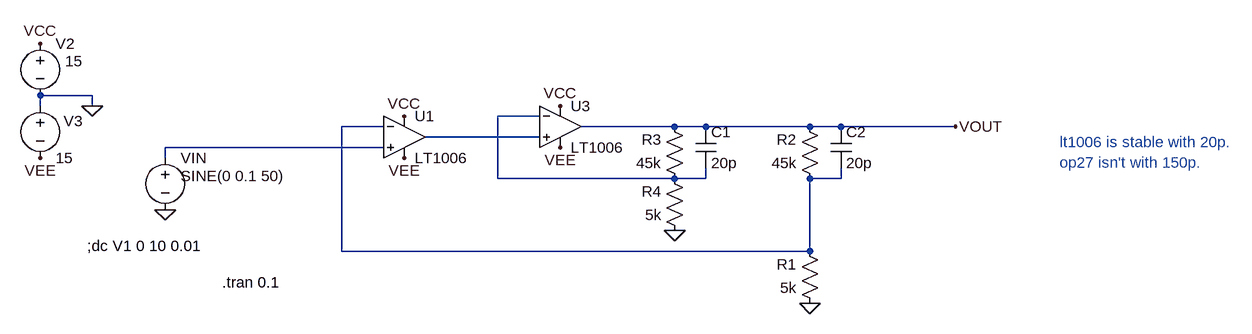
[diagram p0: schematic Draft22.asc]
Draft22.asc, the LTspice schematic file:
Version 4
SHEET 1 1736 680
WIRE -64 32 -144 32
WIRE -144 48 -144 32
WIRE -64 48 -64 32
WIRE 624 64 560 64
WIRE 384 80 320 80
WIRE 832 80 688 80
WIRE 880 80 832 80
WIRE 1040 80 880 80
WIRE 1088 80 1040 80
WIRE 1264 80 1088 80
WIRE 624 96 448 96
WIRE 384 112 48 112
WIRE 48 128 48 112
WIRE 560 160 560 64
WIRE 832 160 560 160
WIRE 880 160 880 144
WIRE 880 160 832 160
WIRE 1088 160 1088 144
WIRE 1088 160 1040 160
WIRE 320 272 320 80
WIRE 1040 272 1040 160
WIRE 1040 272 320 272
FLAG 48 208 0
FLAG -64 48 0
FLAG -144 -48 VCC
FLAG 416 64 VCC
FLAG -144 128 VEE
FLAG 416 128 VEE
FLAG 1264 80 VOUT
FLAG 656 48 VCC
FLAG 656 112 VEE
FLAG 832 240 0
FLAG 1040 352 0
SYMBOL voltage 48 112 R0
WINDOW 123 0 0 Left 0
WINDOW 39 0 0 Left 0
WINDOW 3 24 44 Left 2
SYMATTR Value SINE(0 0.1 50)
SYMATTR InstName VIN
SYMBOL voltage -144 -64 R0
WINDOW 123 0 0 Left 0
WINDOW 39 0 0 Left 0
WINDOW 3 38 43 Left 2
SYMATTR Value 15
SYMATTR InstName V2
SYMBOL voltage -144 32 R0
WINDOW 123 0 0 Left 0
WINDOW 39 0 0 Left 0
WINDOW 0 36 39 Left 2
SYMATTR InstName V3
SYMATTR Value 15
SYMBOL res 1056 176 R180
WINDOW 0 36 76 Left 2
WINDOW 3 36 40 Left 2
SYMATTR InstName R2
SYMATTR Value 45k
SYMBOL res 1056 368 R180
WINDOW 0 36 76 Left 2
WINDOW 3 36 40 Left 2
SYMATTR InstName R1
SYMATTR Value 5k
SYMBOL res 848 176 R180
WINDOW 0 36 76 Left 2
WINDOW 3 36 40 Left 2
SYMATTR InstName R3
SYMATTR Value 45k
SYMBOL res 848 256 R180
WINDOW 0 36 76 Left 2
WINDOW 3 36 40 Left 2
SYMATTR InstName R4
SYMATTR Value 5k
SYMBOL cap 864 80 R0
SYMATTR InstName C1
SYMATTR Value 20p
SYMBOL cap 1072 80 R0
SYMATTR InstName C2
SYMATTR Value 20p
SYMBOL OpAmps\\LT1006 656 16 R0
SYMATTR InstName U3
SYMBOL OpAmps\\LT1006 416 32 R0
SYMATTR InstName U1
TEXT -72 264 Left 2 !;dc V1 0 10 0.01
TEXT 136 320 Left 2 !.tran 0.1
TEXT 1424 104 Left 2 ;lt1006 is stable with 20p.\nop27 isn't with 150p.

The netlist it stands for:
* Draft22.asc
VIN N004 0 SINE(0 0.1 50)
V2 VCC 0 15
V3 0 VEE 15
R2 N002 VOUT 45k
R1 0 N002 5k
R3 N001 VOUT 45k
R4 0 N001 5k
C1 VOUT N001 20p
C2 VOUT N002 20p
XU3 N003 N001 VCC VEE VOUT LT1006  ; pins In+ In- V+ V- OUT
XU1 N004 N002 VCC VEE N003 LT1006  ; pins In+ In- V+ V- OUT
;dc V1 0 10 0.01
.tran 0.1
* lt1006 is stable with 20p.
* op27 isn't with 150p.
.lib LTC.lib
.backanno
.end